# Altium schematic sheet Xmega.SchDoc
size A4; PageSetup: Record=PageOptions|CenterHorizontal=True|CenterVertical=True|PrintScale=0.97|XCorrection=1.00|YCorrection=1.00|PrintKind=1|BorderSize=5000000|LeftOffset=0|BottomOffset=0|Orientation=2|PaperLength=2970|PaperWidth=1000|Scale=100|PaperSource=257|PrintQuality=600|MediaType=1|DitherType=10|PaperKind=A4|PrintScaleMode=1
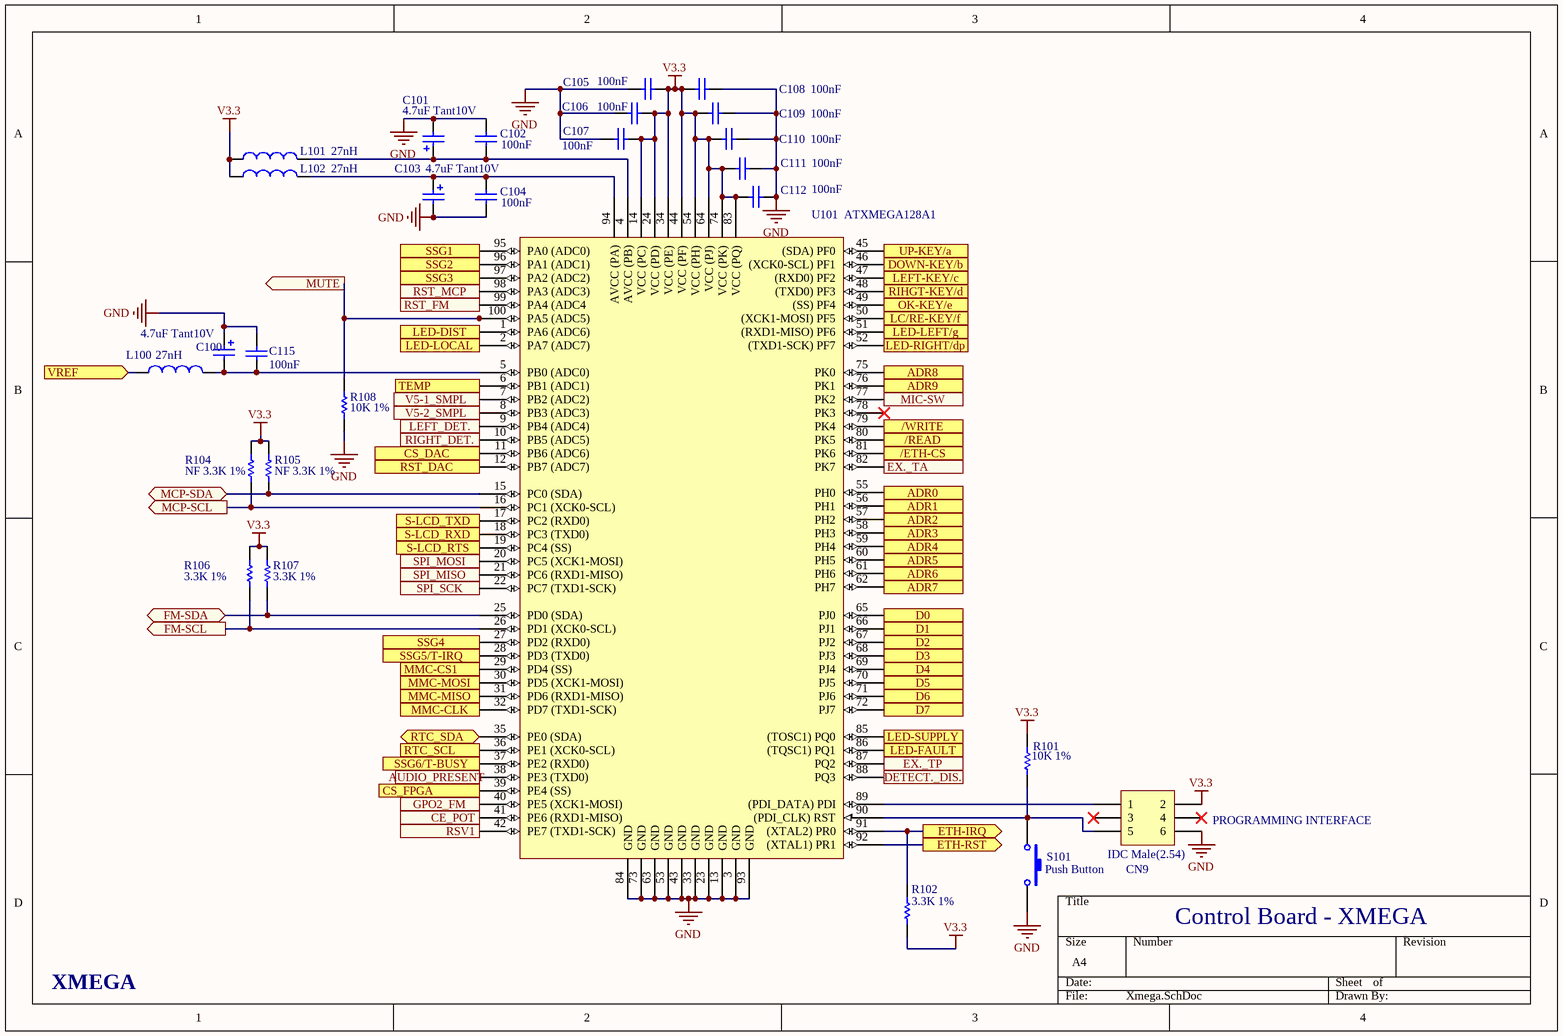
[diagram p0: Xmega.SchDoc]

## Parts
C100  4.7uF Tant10V  [CAP-TAN]
C101  4.7uF Tant10V  [A]
C102  100nF  [1206_FA]
C103  4.7uF Tant10V  [A]
C104  100nF  [1206_FA]
C105  100nF  [1206_FA]
C106  100nF  [1206_FA]
C107  100nF  [1206_FA]
C108  100nF  [1206_FA]
C109  100nF  [1206_FA]
C110  100nF  [1206_FA]
C111  100nF  [1206_FA]
C112  100nF  [1206_FA]
C115  100nF  [0805_FA]
CN9  IDC Male(2.54)  [HDR2X3_M]
L100  27nH  [1210_FA]
L101  27nH  [1210_FA]
L102  27nH  [1210_FA]
R101  10K 1%  [1206_FA]
R102  3.3K 1%  [1206_FA]
R104  NF 3.3K 1%  [1206_FA]
R105  NF 3.3K 1%  [1206_FA]
R106  3.3K 1%  [1206_FA]
R107  3.3K 1%  [1206_FA]
R108  10K 1%  [1206_FA]
S101  Push Button  [SPS2_M(2Pin)]
U101  ATXMEGA128A1  [100T1_N]

## Ports
/ETH-CS (out), /READ (out), /WRITE (out), ADR0 (out), ADR1 (out), ADR2 (out), ADR3 (out), ADR4 (out), ADR5 (out), ADR6 (out), ADR7 (out), ADR8 (out), ADR9 (out), AUDIO_PRESENT (out), CE_POT (in), CS_DAC (out), CS_FPGA (out), D0 (out), D1 (out), D2 (out), D3 (out), D4 (out), D5 (out), D6 (out), D7 (out), DETECT._DIS. (out), DOWN-KEY/b (out), ETH-IRQ (out), ETH-RST (out), EX._TA (out), EX._TP (out), FM-SCL (out), FM-SDA (bidir), GPO2_FM (out), LC/RE-KEY/f (out), LED-DIST (in), LED-FAULT (out), LED-LEFT/g (out), LED-LOCAL (in), LED-RIGHT/dp (out), LED-SUPPLY (out), LEFT-KEY/c (out), LEFT_DET. (in), MCP-SCL (out), MCP-SDA (bidir), MIC-SW (out), MMC-CLK (out), MMC-CS1 (out), MMC-MISO (in), MMC-MOSI (out), MUTE (out), OK-KEY/e (out), RIGHT_DET. (in), RIHGT-KEY/d (out), RST_DAC (out), RST_FM (out), RST_MCP (out), RSV1 (in), RTC_SCL (out), RTC_SDA (bidir), S-LCD_RTS (in), S-LCD_RXD (in), S-LCD_TXD (in), SPI_MISO (out), SPI_MOSI (out), SPI_SCK (out), SSG1 (in), SSG2 (in), SSG3 (in), SSG4 (out), SSG5/T-IRQ (out), SSG6/T-BUSY (out), TEMP (out), UP-KEY/a (out), V5-1_SMPL (in), V5-2_SMPL (in), VREF (in)

## Nets
GND: C100.1 C101.2 C102.2 C103.2 C104.1 C105.2 C106.2 C107.2 C108.1 C109.1 C110.1 C111.1 C112.1 C115.2 CN9.6 R108.1 S101.2 U101.3(GND) U101.13(GND) U101.23(GND) U101.33(GND) U101.43(GND) U101.53(GND) U101.63(GND) U101.73(GND) U101.84(GND) U101.93(GND)
V3.3: C105.1 C106.1 C107.1 C108.2 C109.2 C110.2 C111.2 C112.2 CN9.2 L101.1 L102.1 R101.2 R102.1 R104.2 R105.2 R106.2 R107.2 U101.14(VCC_(PC)) U101.24(VCC_(PD)) U101.34(VCC_(PE)) U101.44(VCC_(PF)) U101.54(VCC_(PH)) U101.64(VCC_(PJ)) U101.74(VCC_(PK)) U101.83(VCC_(PQ))
/ETH-CS: U101.81(PK6) ; port /ETH-CS
/READ: U101.80(PK5) ; port /READ
/WRITE: U101.79(PK4) ; port /WRITE
ADR0: U101.55(PH0) ; port ADR0
ADR1: U101.56(PH1) ; port ADR1
ADR2: U101.57(PH2) ; port ADR2
ADR3: U101.58(PH3) ; port ADR3
ADR4: U101.59(PH4) ; port ADR4
ADR5: U101.60(PH5) ; port ADR5
ADR6: U101.61(PH6) ; port ADR6
ADR7: U101.62(PH7) ; port ADR7
ADR8: U101.75(PK0) ; port ADR8
ADR9: U101.76(PK1) ; port ADR9
AUDIO_PRESENT: U101.38(PE3_(TXD0)) ; port AUDIO_PRESENT
CE_POT: U101.41(PE6_(RXD1-MISO)) ; port CE_POT
CS_DAC: U101.11(PB6_(ADC6)) ; port CS_DAC
CS_FPGA: U101.39(PE4_(SS)) ; port CS_FPGA
D0: U101.65(PJ0) ; port D0
D1: U101.66(PJ1) ; port D1
D2: U101.67(PJ2) ; port D2
D3: U101.68(PJ3) ; port D3
D4: U101.69(PJ4) ; port D4
D5: U101.70(PJ5) ; port D5
D6: U101.71(PJ6) ; port D6
D7: U101.72(PJ7) ; port D7
DETECT._DIS.: U101.88(PQ3) ; port DETECT._DIS.
DOWN-KEY/b: U101.46((XCK0-SCL)_PF1) ; port DOWN-KEY/b
ETH-IRQ: R102.2 U101.91((XTAL2)_PR0) ; port ETH-IRQ
ETH-RST: U101.92((XTAL1)_PR1) ; port ETH-RST
EX._TA: U101.82(PK7) ; port EX._TA
EX._TP: U101.87(PQ2) ; port EX._TP
FM-SCL: R106.1 U101.26(PD1_(XCK0-SCL)) ; port FM-SCL
FM-SDA: R107.1 U101.25(PD0_(SDA)) ; port FM-SDA
GPO2_FM: U101.40(PE5_(XCK1-MOSI)) ; port GPO2_FM
LC/RE-KEY/f: U101.50((XCK1-MOSI)_PF5) ; port LC/RE-KEY/f
LED-DIST: U101.1(PA6_(ADC6)) ; port LED-DIST
LED-FAULT: U101.86((TQSC1)_PQ1) ; port LED-FAULT
LED-LEFT/g: U101.51((RXD1-MISO)_PF6) ; port LED-LEFT/g
LED-LOCAL: U101.2(PA7_(ADC7)) ; port LED-LOCAL
LED-RIGHT/dp: U101.52((TXD1-SCK)_PF7) ; port LED-RIGHT/dp
LED-SUPPLY: U101.85((TOSC1)_PQ0) ; port LED-SUPPLY
LEFT-KEY/c: U101.47((RXD0)_PF2) ; port LEFT-KEY/c
LEFT_DET.: U101.9(PB4_(ADC4)) ; port LEFT_DET.
MCP-SCL: R104.1 U101.16(PC1_(XCK0-SCL)) ; port MCP-SCL
MCP-SDA: R105.1 U101.15(PC0_(SDA)) ; port MCP-SDA
MIC-SW: U101.77(PK2) ; port MIC-SW
MMC-CLK: U101.32(PD7_(TXD1-SCK)) ; port MMC-CLK
MMC-CS1: U101.29(PD4_(SS)) ; port MMC-CS1
MMC-MISO: U101.31(PD6_(RXD1-MISO)) ; port MMC-MISO
MMC-MOSI: U101.30(PD5_(XCK1-MOSI)) ; port MMC-MOSI
MUTE: R108.2 U101.100(PA5_(ADC5)) ; port MUTE
OK-KEY/e: U101.49((SS)_PF4) ; port OK-KEY/e
RIGHT_DET.: U101.10(PB5_(ADC5)) ; port RIGHT_DET.
RIHGT-KEY/d: U101.48((TXD0)_PF3) ; port RIHGT-KEY/d
RST_DAC: U101.12(PB7_(ADC7)) ; port RST_DAC
RST_FM: U101.99(PA4_(ADC4) ; port RST_FM
RST_MCP: U101.98(PA3_(ADC3)) ; port RST_MCP
RSV1: U101.42(PE7_(TXD1-SCK)) ; port RSV1
RTC_SCL: U101.36(PE1_(XCK0-SCL)) ; port RTC_SCL
RTC_SDA: U101.35(PE0_(SDA)) ; port RTC_SDA
S-LCD_RTS: U101.19(PC4_(SS)) ; port S-LCD_RTS
S-LCD_RXD: U101.18(PC3_(TXD0)) ; port S-LCD_RXD
S-LCD_TXD: U101.17(PC2_(RXD0)) ; port S-LCD_TXD
SPI_MISO: U101.21(PC6_(RXD1-MISO)) ; port SPI_MISO
SPI_MOSI: U101.20(PC5_(XCK1-MOSI)) ; port SPI_MOSI
SPI_SCK: U101.22(PC7_(TXD1-SCK)) ; port SPI_SCK
SSG1: U101.95(PA0_(ADC0)) ; port SSG1
SSG2: U101.96(PA1_(ADC1)) ; port SSG2
SSG3: U101.97(PA2_(ADC2)) ; port SSG3
SSG4: U101.27(PD2_(RXD0)) ; port SSG4
SSG5/T-IRQ: U101.28(PD3_(TXD0)) ; port SSG5/T-IRQ
SSG6/T-BUSY: U101.37(PE2_(RXD0)) ; port SSG6/T-BUSY
TEMP: U101.6(PB1_(ADC1)) ; port TEMP
UP-KEY/a: U101.45((SDA)_PF0) ; port UP-KEY/a
V5-1_SMPL: U101.7(PB2_(ADC2)) ; port V5-1_SMPL
V5-2_SMPL: U101.8(PB3_(ADC3)) ; port V5-2_SMPL
VREF: L100.1 ; port VREF
NetC100_2: C100.2 C115.1 L100.2 U101.5(PB0_(ADC0))
NetC101_1: C101.1 C102.1 L101.2 U101.4(AVCC_(PB))
NetC103_1: C103.1 C104.2 L102.2 U101.94(AVCC_(PA))
NetCN9_1: CN9.1 U101.89((PDI_DATA)_PDI)
NetCN9_5: CN9.5 R101.1 S101.1 U101.90((PDI_CLK)_RST)

Not connected (* = marked no-connect by the designer): CN9 3* 4*; U101 78(PK3)*

## Notes on the sheet
- (near CN9) PROGRAMMING INTERFACE
- XMEGA
- Control Board - XMEGA

## Library data of the parts
C100 C101 C103 = Cap Pol3: Polarized Capacitor (Surface Mount); Value: 100pF; Published: 8-Jun-2000; LatestRevisionDate: 17-Jul-2002; LatestRevisionNote: Re-released for DXP Platform.; PackageReference: C0805; Publisher: Altium Limited
C102 C104-C112 = Cap Semi: Capacitor (Semiconductor SIM Model); Value: 100pF; Published: 8-Jun-2000; LatestRevisionDate: 17-Jul-2002; LatestRevisionNote: Re-released for DXP Platform.; PackageReference: C1206; Publisher: Altium Limited
C115 = Cap Semi: Capacitor (Semiconductor SIM Model); Published: 8-Jun-2000; LatestRevisionDate: 29-May-2009; LatestRevisionNote: IPC-7351 Footprint Added.; PackageReference: C1206; Publisher: Altium Limited; PackageDescription: Chip Capacitor; Value: 100nF
CN9 = Header 3X2: LatestRevisionDate: 17-Jul-2002; LatestRevisionNote: Re-released for DXP Platform.; Publisher: Altium Limited
L100-L102 = Inductor: Code_IEC: 1005; Published: 8-Jun-2000; LatestRevisionDate: 17-Jul-2002; LatestRevisionNote: Re-released for DXP Platform.; PackageReference: 0402-A; Publisher: Altium Limited; Code_JEITA: 0402
R101 R102 R104-R108 = Res Semi: Semiconductor Resistor; Value: 1K; Published: 8-Jun-2000; LatestRevisionDate: 17-Jul-2002; LatestRevisionNote: Re-released for DXP Platform.; PackageReference: AXIAL-0.5; Publisher: Altium Limited
S101 = SW-PB: Switch; Published: 24-Mar-1999; LatestRevisionDate: 17-Jul-2002; LatestRevisionNote: Re-released for DXP Platform.; PackageReference: SPST-2; Publisher: Altium Limited
U101 = ATMEGA163_DIP40: Atmel Microcontroller - Library created by carel..  <www.mpfreezone.com>